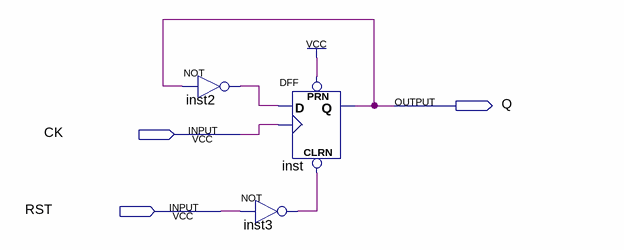
[diagram p0: schematic sheet]
// Quartus schematic ldm_df1.bdf as structural Verilog: 3 symbols, 3 pins
module ldm_df1 (
  input  CK,
  input  RST,
  output Q
);

  wire inst2_out, inst3_out;

  not inst2 (inst2_out, Q);
  DFF inst (.CLRN(inst3_out), .CLK(CK), .D(inst2_out), .PRN(1'b1), .Q(Q));
  not inst3 (inst3_out, RST);
endmodule
